# EAGLE schematic MICROCODE (EAGLE 7.6.0)
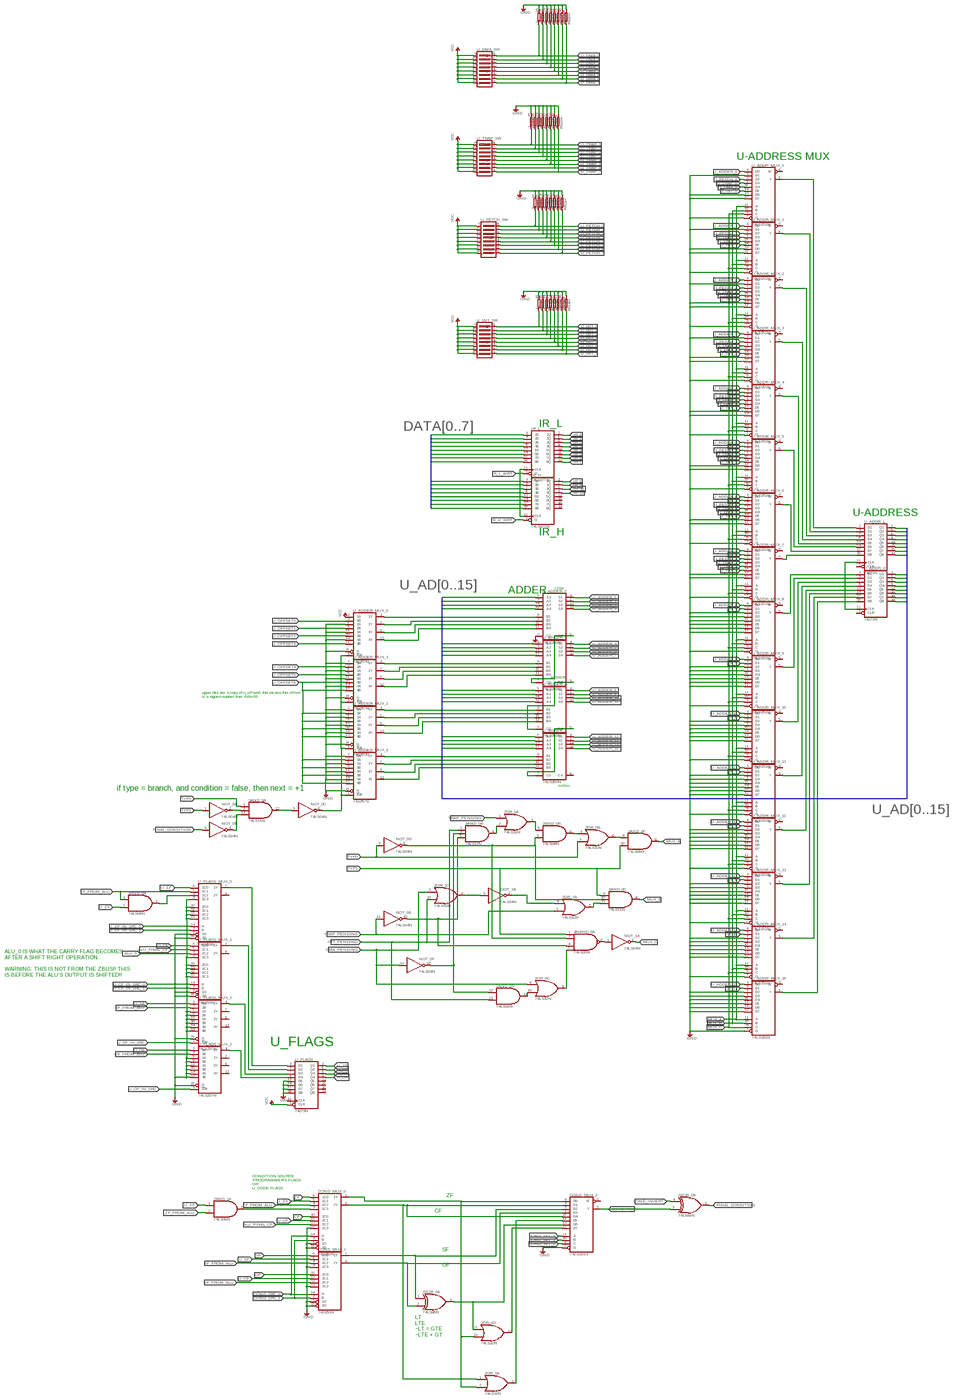
[diagram p0: schematic, sheet 1, overview]
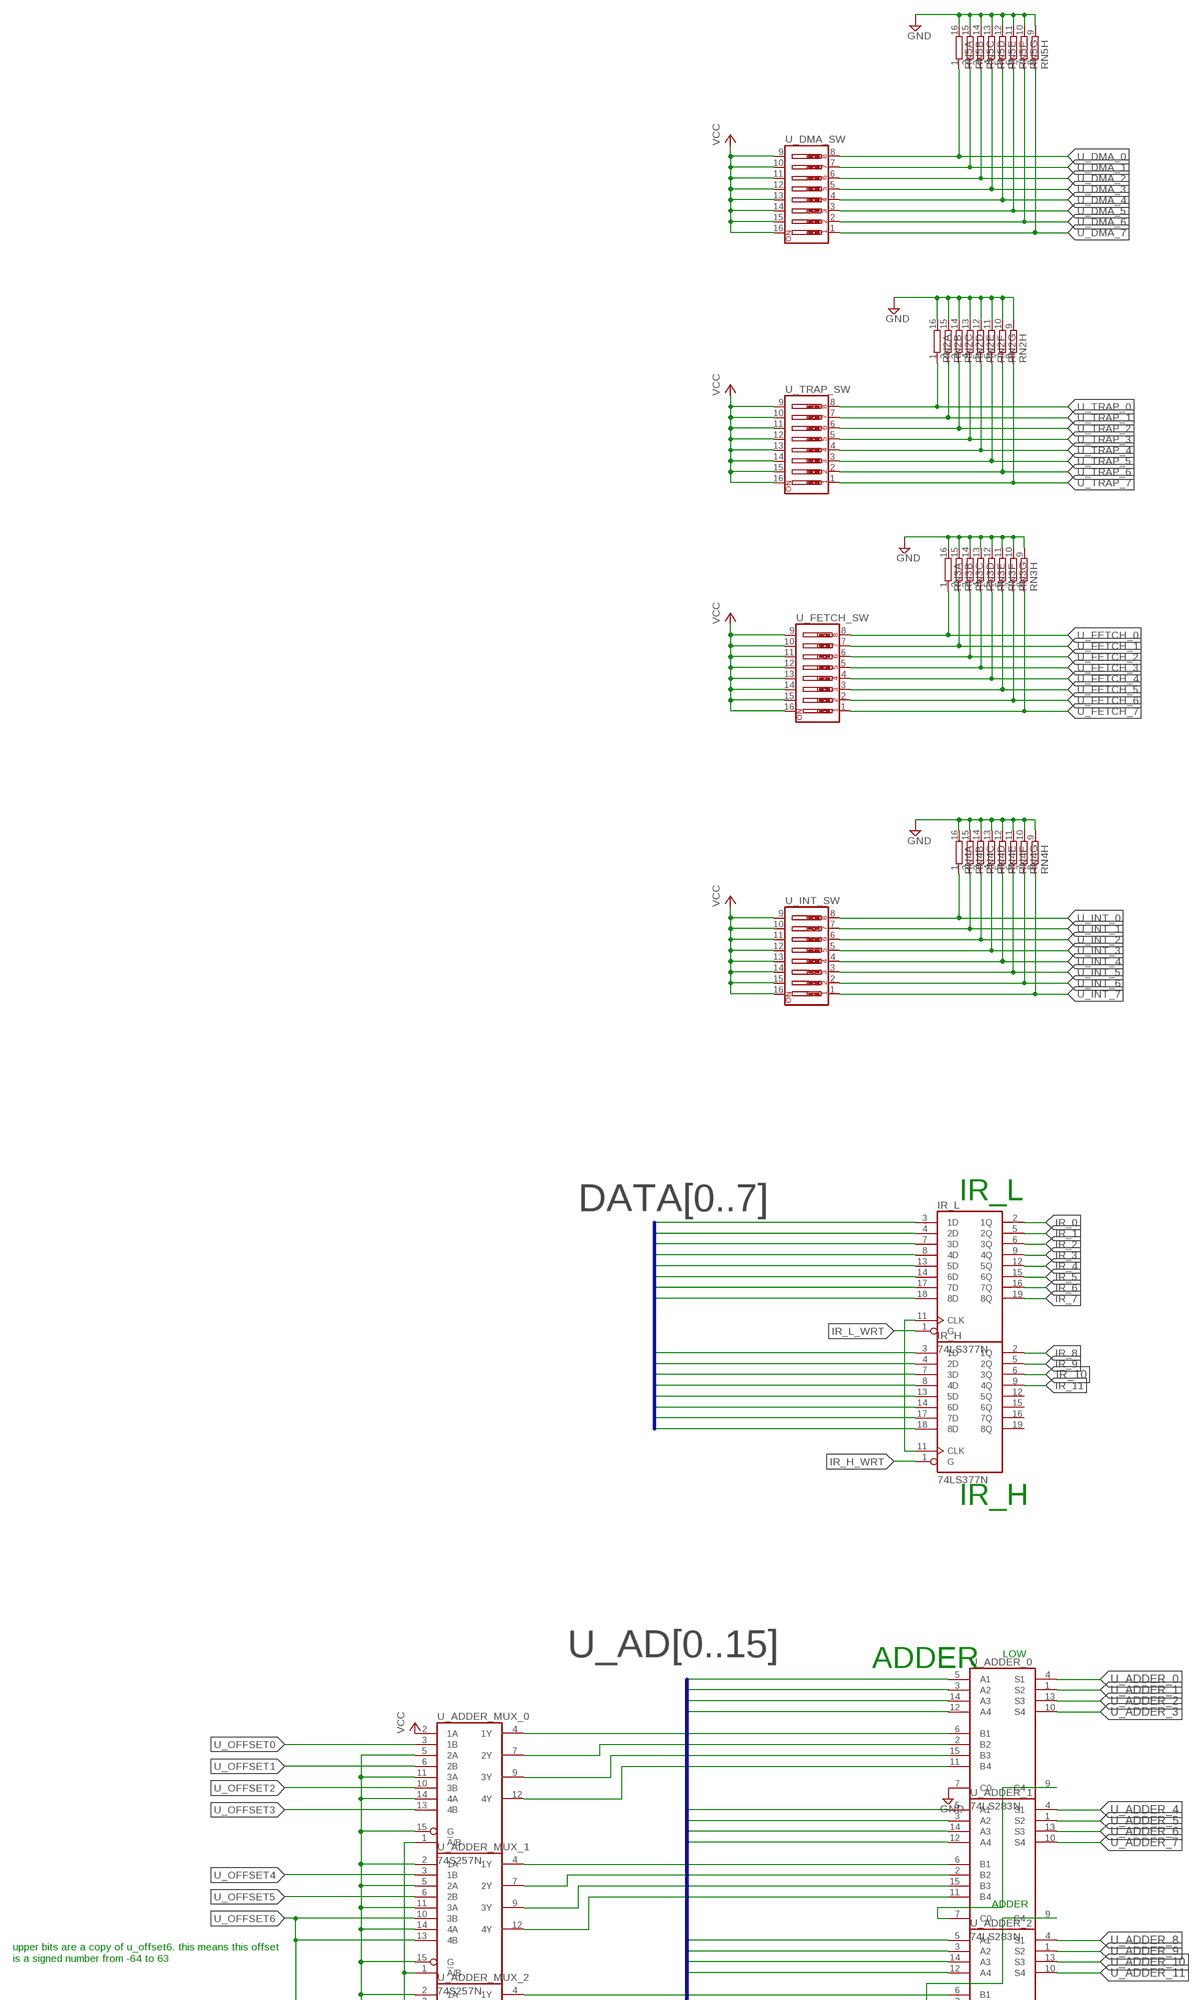
[diagram p1: schematic, sheet 1, part 1 of 4]
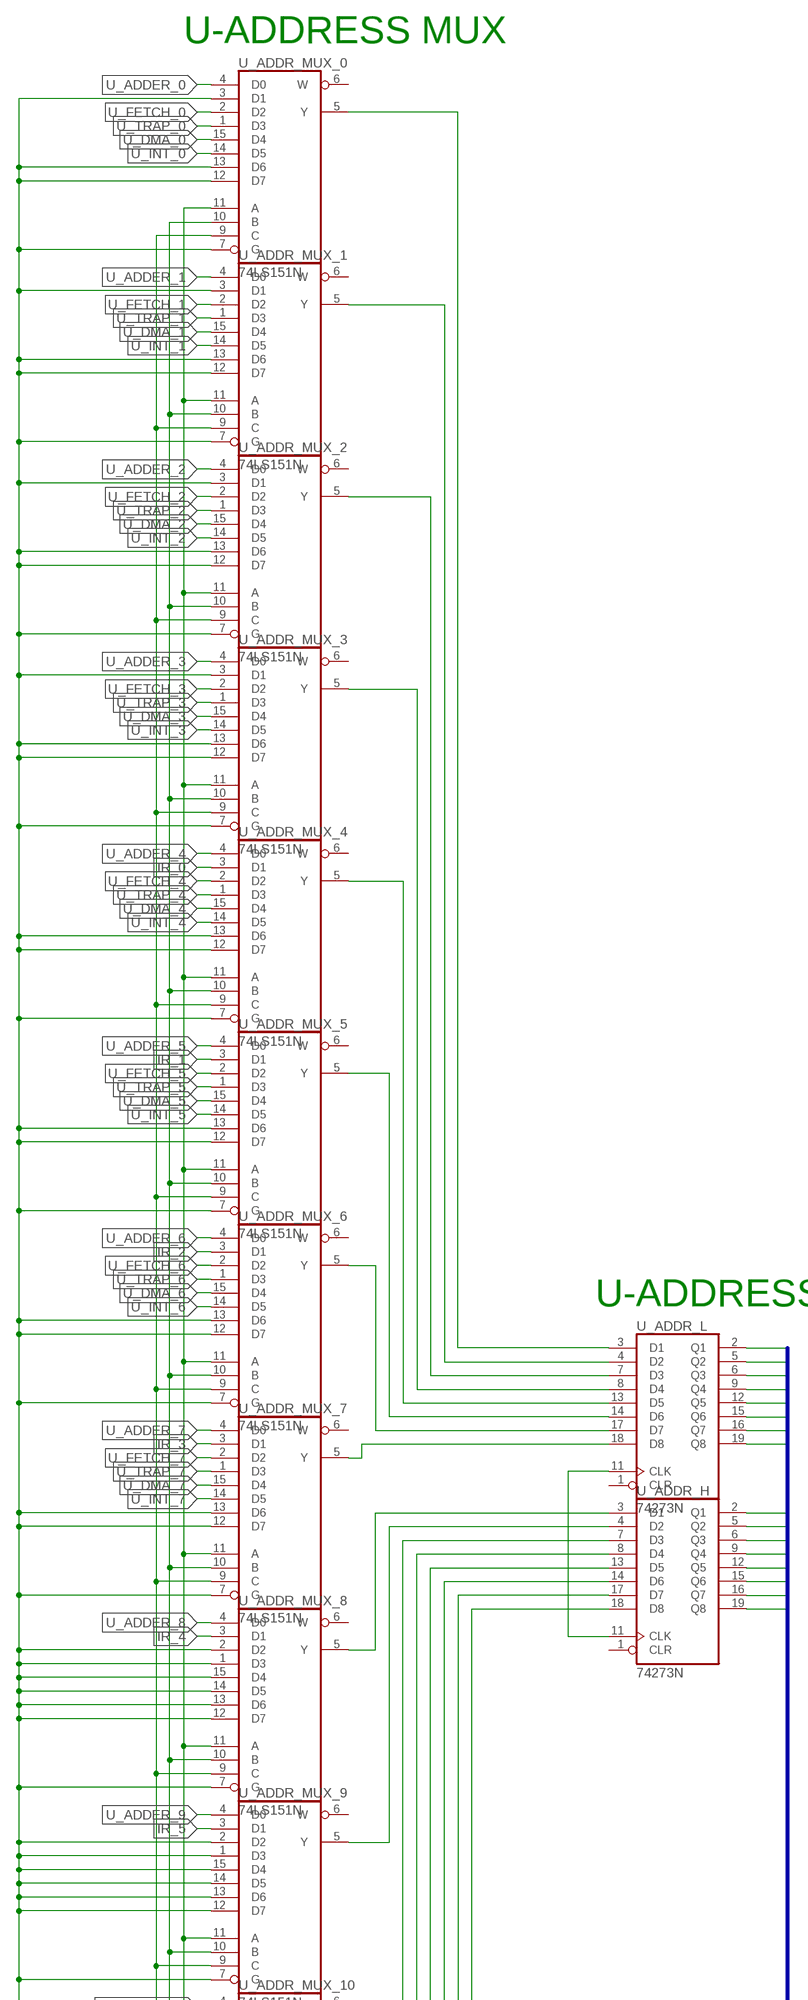
[diagram p2: schematic, sheet 1, part 2 of 4]
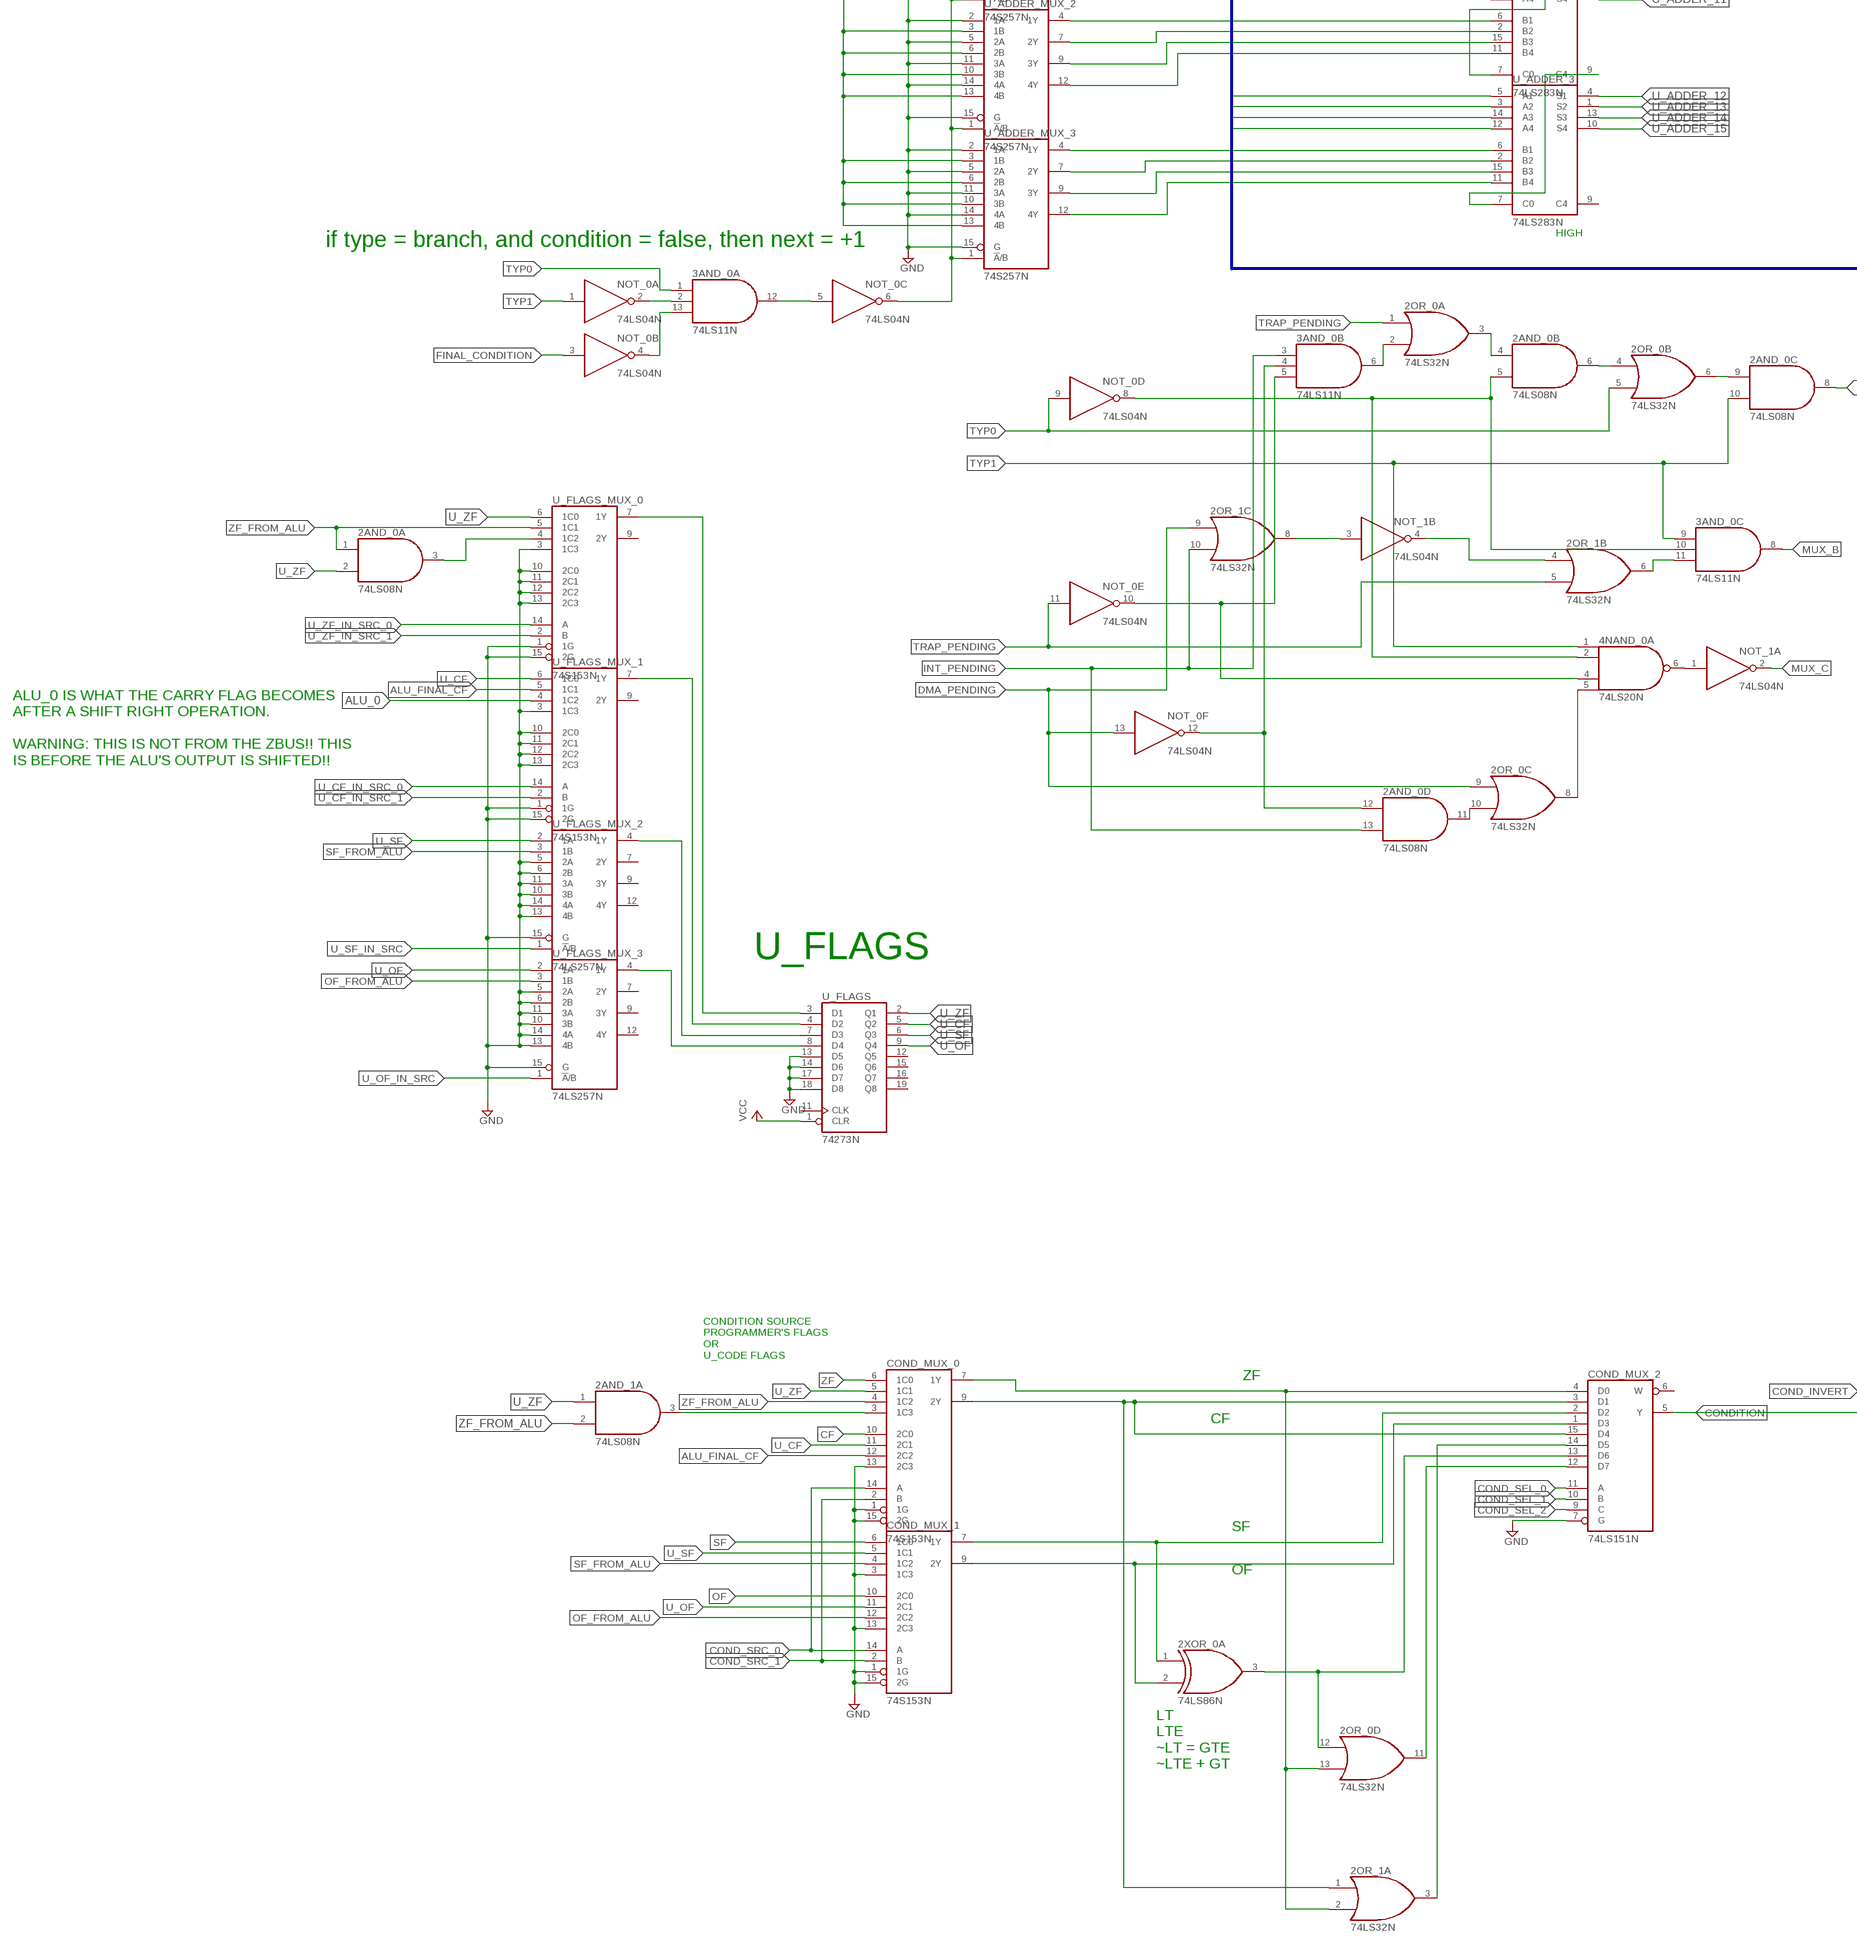
[diagram p3: schematic, sheet 1, part 3 of 4]
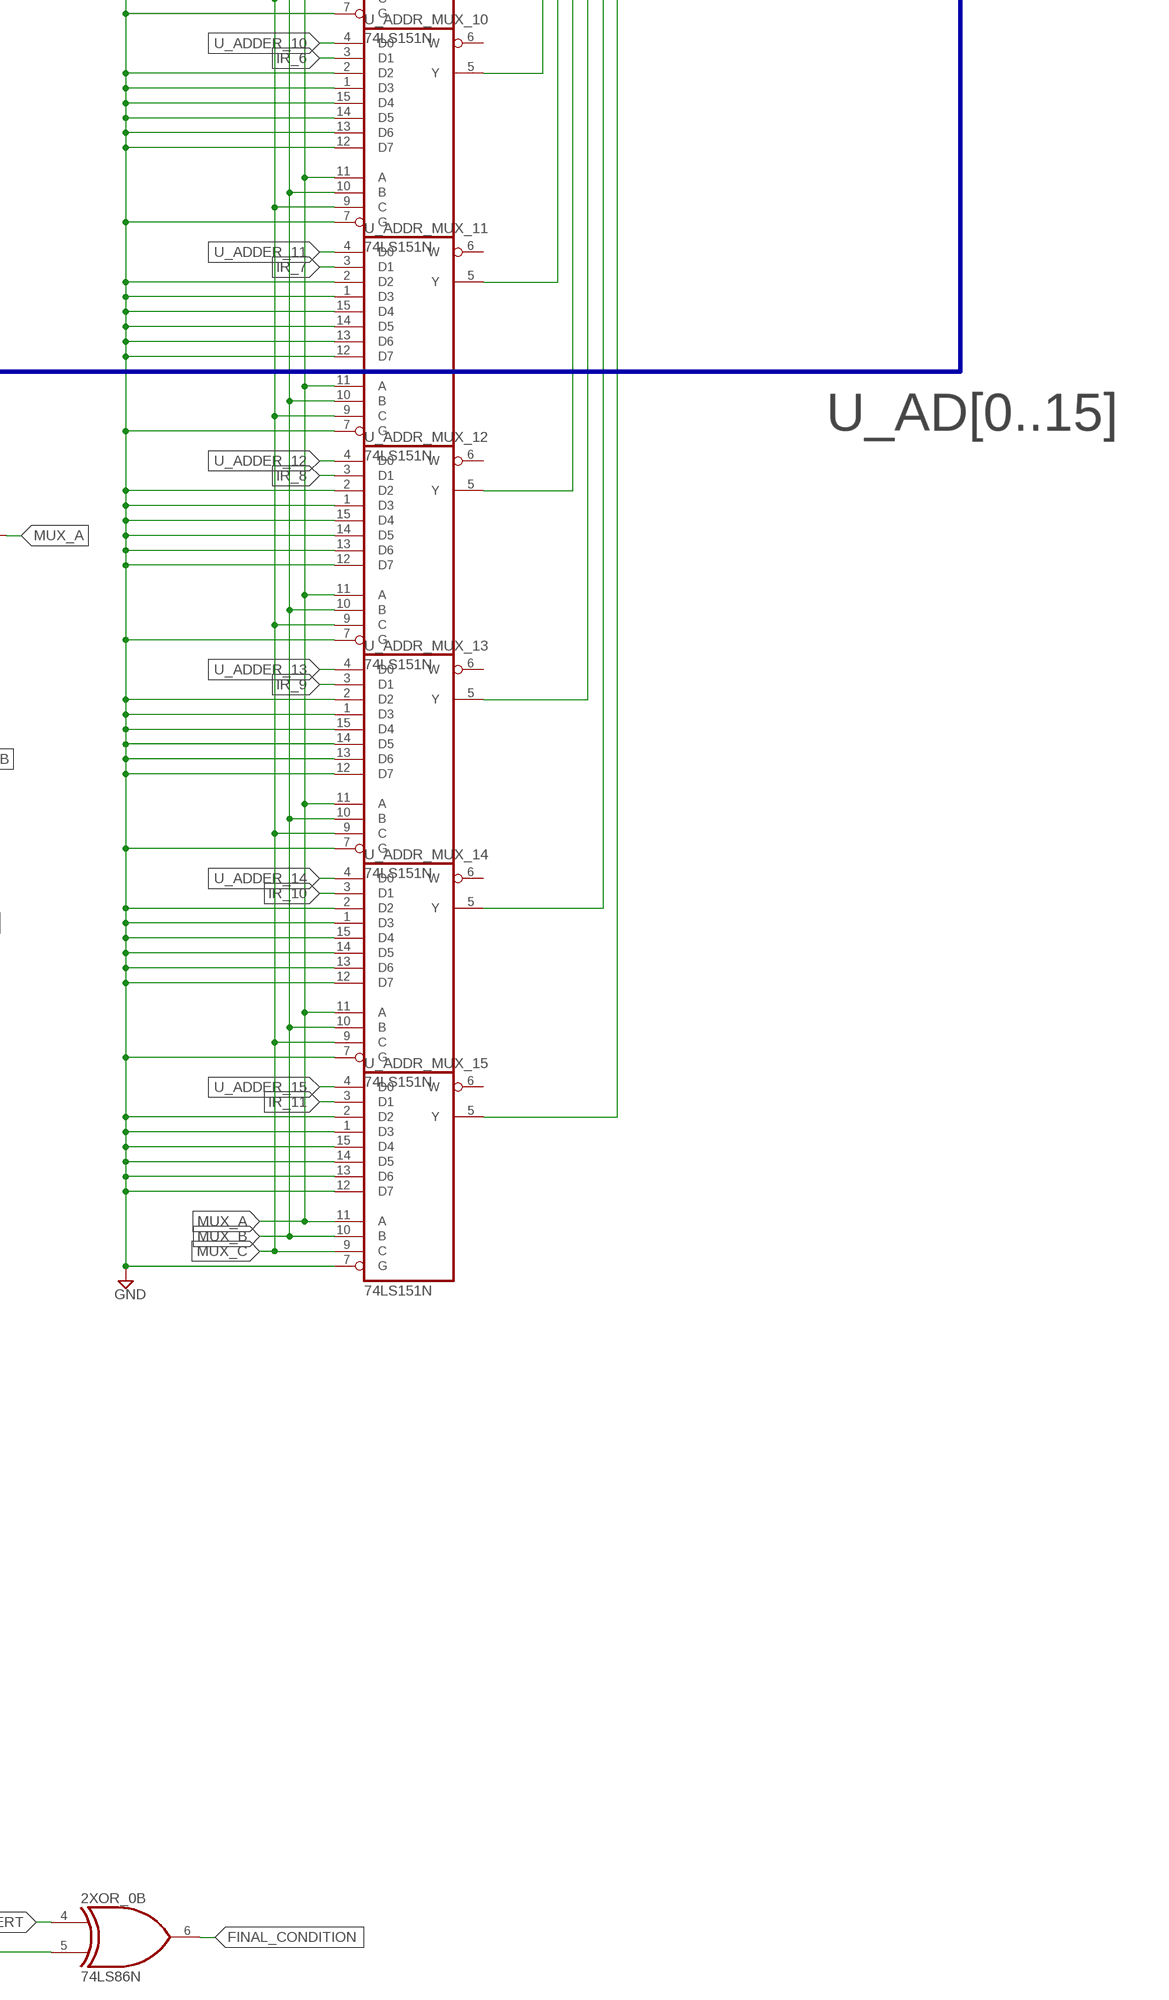
[diagram p4: schematic, sheet 1, part 4 of 4]

## Parts
2AND_0  74LS08N  [DIL14]
2AND_1  74LS08N  [DIL14]
2OR_0  74LS32N  [DIL14]
2OR_1  74LS32N  [DIL14]
2XOR_0  74LS86N  [DIL14]
3AND_0  74LS11N  [DIL14]
4NAND_0  74LS20N  [DIL14]
COND_MUX_0  74S153N  [DIL16]
COND_MUX_1  74S153N  [DIL16]
COND_MUX_2  74LS151N  [DIL16]
IR_H  74LS377N  [DIL20]
IR_L  74LS377N  [DIL20]
NOT_0  74LS04N  [DIL14]
NOT_1  74LS04N  [DIL14]
RN2  8R-N  [DIL16]
RN3  8R-N  [DIL16]
RN4  8R-N  [DIL16]
RN5  8R-N  [DIL16]
U_ADDER_0  74LS283N  [DIL16]
U_ADDER_1  74LS283N  [DIL16]
U_ADDER_2  74LS283N  [DIL16]
U_ADDER_3  74LS283N  [DIL16]
U_ADDER_MUX_0  74S257N  [DIL16]
U_ADDER_MUX_1  74S257N  [DIL16]
U_ADDER_MUX_2  74S257N  [DIL16]
U_ADDER_MUX_3  74S257N  [DIL16]
U_ADDR_H  74273N  [DIL20]
U_ADDR_L  74273N  [DIL20]
U_ADDR_MUX_0  74LS151N  [DIL16]
U_ADDR_MUX_1  74LS151N  [DIL16]
U_ADDR_MUX_2  74LS151N  [DIL16]
U_ADDR_MUX_3  74LS151N  [DIL16]
U_ADDR_MUX_4  74LS151N  [DIL16]
U_ADDR_MUX_5  74LS151N  [DIL16]
U_ADDR_MUX_6  74LS151N  [DIL16]
U_ADDR_MUX_7  74LS151N  [DIL16]
U_ADDR_MUX_8  74LS151N  [DIL16]
U_ADDR_MUX_9  74LS151N  [DIL16]
U_ADDR_MUX_10  74LS151N  [DIL16]
U_ADDR_MUX_11  74LS151N  [DIL16]
U_ADDR_MUX_12  74LS151N  [DIL16]
U_ADDR_MUX_13  74LS151N  [DIL16]
U_ADDR_MUX_14  74LS151N  [DIL16]
U_ADDR_MUX_15  74LS151N  [DIL16]
U_DMA_SW  SW_DIP-8  [EDG-08]
U_FETCH_SW  SW_DIP-8  [EDG-08]
U_FLAGS  74273N  [DIL20]
U_FLAGS_MUX_0  74S153N  [DIL16]
U_FLAGS_MUX_1  74S153N  [DIL16]
U_FLAGS_MUX_2  74LS257N  [DIL16]
U_FLAGS_MUX_3  74LS257N  [DIL16]
U_INT_SW  SW_DIP-8  [EDG-08]
U_TRAP_SW  SW_DIP-8  [EDG-08]

## Nets
1: 2OR_0.13(D:I1) 2OR_1.2(A:I1) COND_MUX_0.7(1Y) COND_MUX_2.4(D0)
2: 2OR_1.1(A:I0) COND_MUX_0.9(2Y) COND_MUX_2.3(D1) COND_MUX_2.15(D4)
3: 2XOR_0.1(A:I0) COND_MUX_1.7(1Y) COND_MUX_2.2(D2)
4: 2XOR_0.2(A:I1) COND_MUX_1.9(2Y) COND_MUX_2.1(D3)
ALU_0: U_FLAGS_MUX_1.4(1C2)
ALU_FINAL_CF: COND_MUX_0.12(2C2) U_FLAGS_MUX_1.5(1C1)
CF: COND_MUX_0.10(2C0)
COND_INVERT: 2XOR_0.4(B:I0)
COND_SEL_0: COND_MUX_2.11(A)
COND_SEL_1: COND_MUX_2.10(B)
COND_SEL_2: COND_MUX_2.9(C)
COND_SRC_0: COND_MUX_0.14(A) COND_MUX_1.14(A)
COND_SRC_1: COND_MUX_0.2(B) COND_MUX_1.2(B)
CONDITION: 2XOR_0.5(B:I1) COND_MUX_2.5(Y)
DATA0: IR_H.3(1D) IR_L.3(1D)
DATA1: IR_H.4(2D) IR_L.4(2D)
DATA2: IR_H.7(3D) IR_L.7(3D)
DATA3: IR_H.8(4D) IR_L.8(4D)
DATA4: IR_H.13(5D) IR_L.13(5D)
DATA5: IR_H.14(6D) IR_L.14(6D)
DATA6: IR_H.17(7D) IR_L.17(7D)
DATA7: IR_H.18(8D) IR_L.18(8D)
DMA_PENDING: 2OR_0.9(C:I0) 2OR_1.9(C:I0) NOT_0.13(F:I)
FINAL_CONDITION: 2XOR_0.6(B:O) NOT_0.3(B:I)
GND: COND_MUX_0.1(1G) COND_MUX_0.13(2C3) COND_MUX_0.15(2G) COND_MUX_1.1(1G) COND_MUX_1.3(1C3) COND_MUX_1.13(2C3) COND_MUX_1.15(2G) COND_MUX_2.7(G) RN2.9 RN2.10 RN2.11 RN2.12 RN2.13 RN2.14 RN2.15 RN2.16 RN3.9 RN3.10 RN3.11 RN3.12 RN3.13 RN3.14 RN3.15 RN3.16 RN4.9 RN4.10 RN4.11 RN4.12 RN4.13 RN4.14 RN4.15 RN4.16 RN5.9 RN5.10 RN5.11 RN5.12 RN5.13 RN5.14 RN5.15 RN5.16 U_ADDER_0.7(C0) U_ADDER_MUX_0.5(2A) U_ADDER_MUX_0.11(3A) U_ADDER_MUX_0.14(4A) U_ADDER_MUX_0.15(G) U_ADDER_MUX_1.2(1A) U_ADDER_MUX_1.5(2A) U_ADDER_MUX_1.11(3A) U_ADDER_MUX_1.14(4A) U_ADDER_MUX_1.15(G) U_ADDER_MUX_2.2(1A) U_ADDER_MUX_2.5(2A) U_ADDER_MUX_2.11(3A) U_ADDER_MUX_2.14(4A) U_ADDER_MUX_2.15(G) U_ADDER_MUX_3.2(1A) U_ADDER_MUX_3.5(2A) U_ADDER_MUX_3.11(3A) U_ADDER_MUX_3.14(4A) U_ADDER_MUX_3.15(G) U_ADDR_MUX_0.3(D1) U_ADDR_MUX_0.7(G) U_ADDR_MUX_0.12(D7) U_ADDR_MUX_0.13(D6) U_ADDR_MUX_1.3(D1) U_ADDR_MUX_1.7(G) U_ADDR_MUX_1.12(D7) U_ADDR_MUX_1.13(D6) U_ADDR_MUX_2.3(D1) U_ADDR_MUX_2.7(G) U_ADDR_MUX_2.12(D7) U_ADDR_MUX_2.13(D6) U_ADDR_MUX_3.3(D1) U_ADDR_MUX_3.7(G) U_ADDR_MUX_3.12(D7) U_ADDR_MUX_3.13(D6) U_ADDR_MUX_4.7(G) U_ADDR_MUX_4.12(D7) U_ADDR_MUX_4.13(D6) U_ADDR_MUX_5.7(G) U_ADDR_MUX_5.12(D7) U_ADDR_MUX_5.13(D6) U_ADDR_MUX_6.7(G) U_ADDR_MUX_6.12(D7) U_ADDR_MUX_6.13(D6) U_ADDR_MUX_7.7(G) U_ADDR_MUX_7.12(D7) U_ADDR_MUX_7.13(D6) U_ADDR_MUX_8.1(D3) U_ADDR_MUX_8.2(D2) U_ADDR_MUX_8.7(G) U_ADDR_MUX_8.12(D7) U_ADDR_MUX_8.13(D6) U_ADDR_MUX_8.14(D5) U_ADDR_MUX_8.15(D4) U_ADDR_MUX_9.1(D3) U_ADDR_MUX_9.2(D2) U_ADDR_MUX_9.7(G) U_ADDR_MUX_9.12(D7) U_ADDR_MUX_9.13(D6) U_ADDR_MUX_9.14(D5) U_ADDR_MUX_9.15(D4) U_ADDR_MUX_10.1(D3) U_ADDR_MUX_10.2(D2) U_ADDR_MUX_10.7(G) U_ADDR_MUX_10.12(D7) U_ADDR_MUX_10.13(D6) U_ADDR_MUX_10.14(D5) U_ADDR_MUX_10.15(D4) U_ADDR_MUX_11.1(D3) U_ADDR_MUX_11.2(D2) U_ADDR_MUX_11.7(G) U_ADDR_MUX_11.12(D7) U_ADDR_MUX_11.13(D6) U_ADDR_MUX_11.14(D5) U_ADDR_MUX_11.15(D4) U_ADDR_MUX_12.1(D3) U_ADDR_MUX_12.2(D2) U_ADDR_MUX_12.7(G) U_ADDR_MUX_12.12(D7) U_ADDR_MUX_12.13(D6) U_ADDR_MUX_12.14(D5) U_ADDR_MUX_12.15(D4) U_ADDR_MUX_13.1(D3) U_ADDR_MUX_13.2(D2) U_ADDR_MUX_13.7(G) U_ADDR_MUX_13.12(D7) U_ADDR_MUX_13.13(D6) U_ADDR_MUX_13.14(D5) U_ADDR_MUX_13.15(D4) U_ADDR_MUX_14.1(D3) U_ADDR_MUX_14.2(D2) U_ADDR_MUX_14.7(G) U_ADDR_MUX_14.12(D7) U_ADDR_MUX_14.13(D6) U_ADDR_MUX_14.14(D5) U_ADDR_MUX_14.15(D4) U_ADDR_MUX_15.1(D3) U_ADDR_MUX_15.2(D2) U_ADDR_MUX_15.7(G) U_ADDR_MUX_15.12(D7) U_ADDR_MUX_15.13(D6) U_ADDR_MUX_15.14(D5) U_ADDR_MUX_15.15(D4) U_FLAGS.13(D5) U_FLAGS.14(D6) U_FLAGS.17(D7) U_FLAGS.18(D8) U_FLAGS_MUX_0.1(1G) U_FLAGS_MUX_0.3(1C3) U_FLAGS_MUX_0.10(2C0) U_FLAGS_MUX_0.11(2C1) U_FLAGS_MUX_0.12(2C2) U_FLAGS_MUX_0.13(2C3) U_FLAGS_MUX_0.15(2G) U_FLAGS_MUX_1.1(1G) U_FLAGS_MUX_1.3(1C3) U_FLAGS_MUX_1.10(2C0) U_FLAGS_MUX_1.11(2C1) U_FLAGS_MUX_1.12(2C2) U_FLAGS_MUX_1.13(2C3) U_FLAGS_MUX_1.15(2G) U_FLAGS_MUX_2.5(2A) U_FLAGS_MUX_2.6(2B) U_FLAGS_MUX_2.10(3B) U_FLAGS_MUX_2.11(3A) U_FLAGS_MUX_2.13(4B) U_FLAGS_MUX_2.14(4A) U_FLAGS_MUX_2.15(G) U_FLAGS_MUX_3.5(2A) U_FLAGS_MUX_3.6(2B) U_FLAGS_MUX_3.10(3B) U_FLAGS_MUX_3.11(3A) U_FLAGS_MUX_3.13(4B) U_FLAGS_MUX_3.14(4A) U_FLAGS_MUX_3.15(G)
INT_PENDING: 2AND_0.13(D:I1) 2OR_1.10(C:I1) 3AND_0.3(B:I0)
IR_0: IR_L.2(1Q) U_ADDR_MUX_4.3(D1)
IR_1: IR_L.5(2Q) U_ADDR_MUX_5.3(D1)
IR_2: IR_L.6(3Q) U_ADDR_MUX_6.3(D1)
IR_3: IR_L.9(4Q) U_ADDR_MUX_7.3(D1)
IR_4: IR_L.12(5Q) U_ADDR_MUX_8.3(D1)
IR_5: IR_L.15(6Q) U_ADDR_MUX_9.3(D1)
IR_6: IR_L.16(7Q) U_ADDR_MUX_10.3(D1)
IR_7: IR_L.19(8Q) U_ADDR_MUX_11.3(D1)
IR_8: IR_H.2(1Q) U_ADDR_MUX_12.3(D1)
IR_9: IR_H.5(2Q) U_ADDR_MUX_13.3(D1)
IR_10: IR_H.6(3Q) U_ADDR_MUX_14.3(D1)
IR_11: IR_H.9(4Q) U_ADDR_MUX_15.3(D1)
IR_H_WRT: IR_H.1(G)
IR_L_WRT: IR_L.1(G)
MUX_A: 2AND_0.8(C:O) U_ADDR_MUX_0.11(A) U_ADDR_MUX_1.11(A) U_ADDR_MUX_2.11(A) U_ADDR_MUX_3.11(A) U_ADDR_MUX_4.11(A) U_ADDR_MUX_5.11(A) U_ADDR_MUX_6.11(A) U_ADDR_MUX_7.11(A) U_ADDR_MUX_8.11(A) U_ADDR_MUX_9.11(A) U_ADDR_MUX_10.11(A) U_ADDR_MUX_11.11(A) U_ADDR_MUX_12.11(A) U_ADDR_MUX_13.11(A) U_ADDR_MUX_14.11(A) U_ADDR_MUX_15.11(A)
MUX_B: 3AND_0.8(C:O) U_ADDR_MUX_0.10(B) U_ADDR_MUX_1.10(B) U_ADDR_MUX_2.10(B) U_ADDR_MUX_3.10(B) U_ADDR_MUX_4.10(B) U_ADDR_MUX_5.10(B) U_ADDR_MUX_6.10(B) U_ADDR_MUX_7.10(B) U_ADDR_MUX_8.10(B) U_ADDR_MUX_9.10(B) U_ADDR_MUX_10.10(B) U_ADDR_MUX_11.10(B) U_ADDR_MUX_12.10(B) U_ADDR_MUX_13.10(B) U_ADDR_MUX_14.10(B) U_ADDR_MUX_15.10(B)
MUX_C: NOT_1.2(A:O) U_ADDR_MUX_0.9(C) U_ADDR_MUX_1.9(C) U_ADDR_MUX_2.9(C) U_ADDR_MUX_3.9(C) U_ADDR_MUX_4.9(C) U_ADDR_MUX_5.9(C) U_ADDR_MUX_6.9(C) U_ADDR_MUX_7.9(C) U_ADDR_MUX_8.9(C) U_ADDR_MUX_9.9(C) U_ADDR_MUX_10.9(C) U_ADDR_MUX_11.9(C) U_ADDR_MUX_12.9(C) U_ADDR_MUX_13.9(C) U_ADDR_MUX_14.9(C) U_ADDR_MUX_15.9(C)
N$1: 2AND_1.3(A:O) COND_MUX_0.3(1C3)
N$2: 3AND_0.12(A:O) NOT_0.5(C:I)
N$3: U_ADDER_0.9(C4) U_ADDER_1.7(C0)
N$4: U_ADDER_2.9(C4) U_ADDER_3.7(C0)
N$5: U_ADDER_0.6(B1) U_ADDER_MUX_0.4(1Y)
N$6: U_ADDER_0.2(B2) U_ADDER_MUX_0.7(2Y)
N$7: U_ADDER_0.15(B3) U_ADDER_MUX_0.9(3Y)
N$8: U_ADDER_0.11(B4) U_ADDER_MUX_0.12(4Y)
N$9: U_ADDER_1.6(B1) U_ADDER_MUX_1.4(1Y)
N$10: U_ADDER_1.2(B2) U_ADDER_MUX_1.7(2Y)
N$11: U_ADDER_1.15(B3) U_ADDER_MUX_1.9(3Y)
N$12: 4NAND_0.6(A:O) NOT_1.1(A:I)
N$13: U_ADDER_1.11(B4) U_ADDER_MUX_1.12(4Y)
N$14: 2OR_1.6(B:O) 3AND_0.11(C:I2)
N$15: U_ADDER_2.6(B1) U_ADDER_MUX_2.4(1Y)
N$16: U_ADDER_2.2(B2) U_ADDER_MUX_2.7(2Y)
N$17: U_ADDER_2.15(B3) U_ADDER_MUX_2.9(3Y)
N$18: U_ADDER_2.11(B4) U_ADDER_MUX_2.12(4Y)
N$19: U_ADDER_3.6(B1) U_ADDER_MUX_3.4(1Y)
N$20: U_ADDER_3.2(B2) U_ADDER_MUX_3.7(2Y)
N$21: NOT_0.6(C:O) U_ADDER_MUX_0.1(!A!/B) U_ADDER_MUX_1.1(!A!/B) U_ADDER_MUX_2.1(!A!/B) U_ADDER_MUX_3.1(!A!/B)
N$22: 3AND_0.13(A:I2) NOT_0.4(B:O)
N$23: 3AND_0.2(A:I1) NOT_0.2(A:O)
N$24: U_ADDR_L.3(D1) U_ADDR_MUX_0.5(Y)
N$25: U_ADDR_L.4(D2) U_ADDR_MUX_1.5(Y)
N$26: U_ADDR_L.7(D3) U_ADDR_MUX_2.5(Y)
N$27: U_ADDR_L.8(D4) U_ADDR_MUX_3.5(Y)
N$28: U_ADDR_L.13(D5) U_ADDR_MUX_4.5(Y)
N$29: U_ADDR_L.14(D6) U_ADDR_MUX_5.5(Y)
N$30: U_ADDR_L.17(D7) U_ADDR_MUX_6.5(Y)
N$31: U_ADDR_L.18(D8) U_ADDR_MUX_7.5(Y)
N$32: U_ADDR_H.3(D1) U_ADDR_MUX_8.5(Y)
N$33: U_ADDR_H.4(D2) U_ADDR_MUX_9.5(Y)
N$34: U_ADDR_H.7(D3) U_ADDR_MUX_10.5(Y)
N$35: U_ADDR_H.11(CLK) U_ADDR_L.11(CLK)
N$36: IR_H.11(CLK) IR_L.11(CLK)
N$37: 2OR_1.4(B:I0) NOT_1.4(B:O)
N$38: 2OR_1.8(C:O) NOT_1.3(B:I)
N$41: U_ADDR_H.8(D4) U_ADDR_MUX_11.5(Y)
N$42: U_ADDR_H.13(D5) U_ADDR_MUX_12.5(Y)
N$43: U_ADDR_H.14(D6) U_ADDR_MUX_13.5(Y)
N$45: U_ADDER_3.15(B3) U_ADDER_MUX_3.9(3Y)
N$46: U_ADDER_3.11(B4) U_ADDER_MUX_3.12(4Y)
N$47: U_FLAGS.4(D2) U_FLAGS_MUX_1.7(1Y)
N$48: 2AND_0.3(A:O) U_FLAGS_MUX_0.4(1C2)
N$49: U_FLAGS.3(D1) U_FLAGS_MUX_0.7(1Y)
N$50: U_FLAGS.8(D4) U_FLAGS_MUX_3.4(1Y)
N$51: U_FLAGS.7(D3) U_FLAGS_MUX_2.4(1Y)
N$86: 2OR_1.3(A:O) COND_MUX_2.14(D5)
N$93: 2OR_0.11(D:O) COND_MUX_2.12(D7)
N$94: 2AND_0.9(C:I0) 2OR_0.6(B:O)
N$130: 2AND_0.6(B:O) 2OR_0.4(B:I0)
N$173: 2AND_0.5(B:I1) 3AND_0.10(C:I1) 4NAND_0.2(A:I1) NOT_0.8(D:O)
N$225: U_ADDR_H.17(D7) U_ADDR_MUX_14.5(Y)
N$228: U_ADDR_H.18(D8) U_ADDR_MUX_15.5(Y)
N$358: U_ADDER_1.9(C4) U_ADDER_2.7(C0)
N$705: 2AND_0.4(B:I0) 2OR_0.3(A:O)
N$706: 2OR_0.2(A:I1) 3AND_0.6(B:O)
N$707: 3AND_0.5(B:I2) 4NAND_0.4(A:I2) NOT_0.10(E:O)
N$708: 2AND_0.12(D:I0) 3AND_0.4(B:I1) NOT_0.12(F:O)
N$710: 2AND_0.11(D:O) 2OR_0.10(C:I1)
N$711: 2OR_0.8(C:O) 4NAND_0.5(A:I3)
OF: COND_MUX_1.10(2C0)
OF_FROM_ALU: COND_MUX_1.12(2C2) U_FLAGS_MUX_3.3(1B)
SF: COND_MUX_1.6(1C0)
SF_FROM_ALU: COND_MUX_1.4(1C2) U_FLAGS_MUX_2.3(1B)
SF_XOR_OF1: 2OR_0.12(D:I0) 2XOR_0.3(A:O) COND_MUX_2.13(D6)
TRAP_PENDING: 2OR_0.1(A:I0) 2OR_1.5(B:I1) NOT_0.11(E:I)
TYP0: 2OR_0.5(B:I1) 3AND_0.1(A:I0) NOT_0.9(D:I)
TYP1: 2AND_0.10(C:I1) 3AND_0.9(C:I0) 4NAND_0.1(A:I0) NOT_0.1(A:I)
U_AD0: U_ADDER_0.5(A1) U_ADDR_L.2(Q1)
U_AD1: U_ADDER_0.3(A2) U_ADDR_L.5(Q2)
U_AD2: U_ADDER_0.14(A3) U_ADDR_L.6(Q3)
U_AD3: U_ADDER_0.12(A4) U_ADDR_L.9(Q4)
U_AD4: U_ADDER_1.5(A1) U_ADDR_L.12(Q5)
U_AD5: U_ADDER_1.3(A2) U_ADDR_L.15(Q6)
U_AD6: U_ADDER_1.14(A3) U_ADDR_L.16(Q7)
U_AD7: U_ADDER_1.12(A4) U_ADDR_L.19(Q8)
U_AD8: U_ADDER_2.5(A1) U_ADDR_H.2(Q1)
U_AD9: U_ADDER_2.3(A2) U_ADDR_H.5(Q2)
U_AD10: U_ADDER_2.14(A3) U_ADDR_H.6(Q3)
U_AD11: U_ADDER_2.12(A4) U_ADDR_H.9(Q4)
U_AD12: U_ADDER_3.5(A1) U_ADDR_H.12(Q5)
U_AD13: U_ADDER_3.3(A2) U_ADDR_H.15(Q6)
U_AD14: U_ADDER_3.14(A3) U_ADDR_H.16(Q7)
U_AD15: U_ADDER_3.12(A4) U_ADDR_H.19(Q8)
U_ADDER_0: U_ADDER_0.4(S1) U_ADDR_MUX_0.4(D0)
U_ADDER_1: U_ADDER_0.1(S2) U_ADDR_MUX_1.4(D0)
U_ADDER_2: U_ADDER_0.13(S3) U_ADDR_MUX_2.4(D0)
U_ADDER_3: U_ADDER_0.10(S4) U_ADDR_MUX_3.4(D0)
U_ADDER_4: U_ADDER_1.4(S1) U_ADDR_MUX_4.4(D0)
U_ADDER_5: U_ADDER_1.1(S2) U_ADDR_MUX_5.4(D0)
U_ADDER_6: U_ADDER_1.13(S3) U_ADDR_MUX_6.4(D0)
U_ADDER_7: U_ADDER_1.10(S4) U_ADDR_MUX_7.4(D0)
U_ADDER_8: U_ADDER_2.4(S1) U_ADDR_MUX_8.4(D0)
U_ADDER_9: U_ADDER_2.1(S2) U_ADDR_MUX_9.4(D0)
U_ADDER_10: U_ADDER_2.13(S3) U_ADDR_MUX_10.4(D0)
U_ADDER_11: U_ADDER_2.10(S4) U_ADDR_MUX_11.4(D0)
U_ADDER_12: U_ADDER_3.4(S1) U_ADDR_MUX_12.4(D0)
U_ADDER_13: U_ADDER_3.1(S2) U_ADDR_MUX_13.4(D0)
U_ADDER_14: U_ADDER_3.13(S3) U_ADDR_MUX_14.4(D0)
U_ADDER_15: U_ADDER_3.10(S4) U_ADDR_MUX_15.4(D0)
U_CF: COND_MUX_0.11(2C1) U_FLAGS.5(Q2) U_FLAGS_MUX_1.6(1C0)
U_CF_IN_SRC_0: U_FLAGS_MUX_1.14(A)
U_CF_IN_SRC_1: U_FLAGS_MUX_1.2(B)
U_DMA_0: RN5.1 U_ADDR_MUX_0.15(D4) U_DMA_SW.8
U_DMA_1: RN5.2 U_ADDR_MUX_1.15(D4) U_DMA_SW.7
U_DMA_2: RN5.3 U_ADDR_MUX_2.15(D4) U_DMA_SW.6
U_DMA_3: RN5.4 U_ADDR_MUX_3.15(D4) U_DMA_SW.5
U_DMA_4: RN5.5 U_ADDR_MUX_4.15(D4) U_DMA_SW.4
U_DMA_5: RN5.6 U_ADDR_MUX_5.15(D4) U_DMA_SW.3
U_DMA_6: RN5.7 U_ADDR_MUX_6.15(D4) U_DMA_SW.2
U_DMA_7: RN5.8 U_ADDR_MUX_7.15(D4) U_DMA_SW.1
U_FETCH_0: RN3.1 U_ADDR_MUX_0.2(D2) U_FETCH_SW.8
U_FETCH_1: RN3.2 U_ADDR_MUX_1.2(D2) U_FETCH_SW.7
U_FETCH_2: RN3.3 U_ADDR_MUX_2.2(D2) U_FETCH_SW.6
U_FETCH_3: RN3.4 U_ADDR_MUX_3.2(D2) U_FETCH_SW.5
U_FETCH_4: RN3.5 U_ADDR_MUX_4.2(D2) U_FETCH_SW.4
U_FETCH_5: RN3.6 U_ADDR_MUX_5.2(D2) U_FETCH_SW.3
U_FETCH_6: RN3.7 U_ADDR_MUX_6.2(D2) U_FETCH_SW.2
U_FETCH_7: RN3.8 U_ADDR_MUX_7.2(D2) U_FETCH_SW.1
U_INT_0: RN4.1 U_ADDR_MUX_0.14(D5) U_INT_SW.8
U_INT_1: RN4.2 U_ADDR_MUX_1.14(D5) U_INT_SW.7
U_INT_2: RN4.3 U_ADDR_MUX_2.14(D5) U_INT_SW.6
U_INT_3: RN4.4 U_ADDR_MUX_3.14(D5) U_INT_SW.5
U_INT_4: RN4.5 U_ADDR_MUX_4.14(D5) U_INT_SW.4
U_INT_5: RN4.6 U_ADDR_MUX_5.14(D5) U_INT_SW.3
U_INT_6: RN4.7 U_ADDR_MUX_6.14(D5) U_INT_SW.2
U_INT_7: RN4.8 U_ADDR_MUX_7.14(D5) U_INT_SW.1
U_OF: COND_MUX_1.11(2C1) U_FLAGS.9(Q4) U_FLAGS_MUX_3.2(1A)
U_OF_IN_SRC: U_FLAGS_MUX_3.1(!A!/B)
U_OFFSET0: U_ADDER_MUX_0.3(1B)
U_OFFSET1: U_ADDER_MUX_0.6(2B)
U_OFFSET2: U_ADDER_MUX_0.10(3B)
U_OFFSET3: U_ADDER_MUX_0.13(4B)
U_OFFSET4: U_ADDER_MUX_1.3(1B)
U_OFFSET5: U_ADDER_MUX_1.6(2B)
U_OFFSET6: U_ADDER_MUX_1.10(3B) U_ADDER_MUX_1.13(4B) U_ADDER_MUX_2.3(1B) U_ADDER_MUX_2.6(2B) U_ADDER_MUX_2.10(3B) U_ADDER_MUX_2.13(4B) U_ADDER_MUX_3.3(1B) U_ADDER_MUX_3.6(2B) U_ADDER_MUX_3.10(3B) U_ADDER_MUX_3.13(4B)
U_SF: COND_MUX_1.5(1C1) U_FLAGS.6(Q3) U_FLAGS_MUX_2.2(1A)
U_SF_IN_SRC: U_FLAGS_MUX_2.1(!A!/B)
U_TRAP_0: RN2.1 U_ADDR_MUX_0.1(D3) U_TRAP_SW.8
U_TRAP_1: RN2.2 U_ADDR_MUX_1.1(D3) U_TRAP_SW.7
U_TRAP_2: RN2.3 U_ADDR_MUX_2.1(D3) U_TRAP_SW.6
U_TRAP_3: RN2.4 U_ADDR_MUX_3.1(D3) U_TRAP_SW.5
U_TRAP_4: RN2.5 U_ADDR_MUX_4.1(D3) U_TRAP_SW.4
U_TRAP_5: RN2.6 U_ADDR_MUX_5.1(D3) U_TRAP_SW.3
U_TRAP_6: RN2.7 U_ADDR_MUX_6.1(D3) U_TRAP_SW.2
U_TRAP_7: RN2.8 U_ADDR_MUX_7.1(D3) U_TRAP_SW.1
U_ZF: 2AND_0.2(A:I1) 2AND_1.1(A:I0) COND_MUX_0.5(1C1) U_FLAGS.2(Q1) U_FLAGS_MUX_0.6(1C0)
U_ZF_IN_SRC_0: U_FLAGS_MUX_0.14(A)
U_ZF_IN_SRC_1: U_FLAGS_MUX_0.2(B)
VCC: U_ADDER_MUX_0.2(1A) U_DMA_SW.9 U_DMA_SW.10 U_DMA_SW.11 U_DMA_SW.12 U_DMA_SW.13 U_DMA_SW.14 U_DMA_SW.15 U_DMA_SW.16 U_FETCH_SW.9 U_FETCH_SW.10 U_FETCH_SW.11 U_FETCH_SW.12 U_FETCH_SW.13 U_FETCH_SW.14 U_FETCH_SW.15 U_FETCH_SW.16 U_FLAGS.1(CLR) U_INT_SW.9 U_INT_SW.10 U_INT_SW.11 U_INT_SW.12 U_INT_SW.13 U_INT_SW.14 U_INT_SW.15 U_INT_SW.16 U_TRAP_SW.9 U_TRAP_SW.10 U_TRAP_SW.11 U_TRAP_SW.12 U_TRAP_SW.13 U_TRAP_SW.14 U_TRAP_SW.15 U_TRAP_SW.16
ZF: COND_MUX_0.6(1C0)
ZF_FROM_ALU: 2AND_0.1(A:I0) 2AND_1.2(A:I1) COND_MUX_0.4(1C2) U_FLAGS_MUX_0.5(1C1)
Unconnected: 2AND_1.4(B:I0) 2AND_1.5(B:I1) 2AND_1.6(B:O) 2AND_1.8(C:O) 2AND_1.9(C:I0) 2AND_1.10(C:I1) 2AND_1.11(D:O) 2AND_1.12(D:I0) 2AND_1.13(D:I1) 2OR_1.11(D:O) 2OR_1.12(D:I0) 2OR_1.13(D:I1) 2XOR_0.8(C:O) 2XOR_0.9(C:I0) 2XOR_0.10(C:I1) 2XOR_0.11(D:O) 2XOR_0.12(D:I0) 2XOR_0.13(D:I1) 4NAND_0.8(B:O) 4NAND_0.9(B:I0) 4NAND_0.10(B:I1) 4NAND_0.12(B:I2) 4NAND_0.13(B:I3) COND_MUX_2.6(W) IR_H.12(5Q) IR_H.15(6Q) IR_H.16(7Q) IR_H.19(8Q) NOT_1.5(C:I) NOT_1.6(C:O) NOT_1.8(D:O) NOT_1.9(D:I) NOT_1.10(E:O) NOT_1.11(E:I) NOT_1.12(F:O) NOT_1.13(F:I) U_ADDER_3.9(C4) U_ADDR_H.1(CLR) U_ADDR_L.1(CLR) U_ADDR_MUX_0.6(W) U_ADDR_MUX_1.6(W) U_ADDR_MUX_2.6(W) U_ADDR_MUX_3.6(W) U_ADDR_MUX_4.6(W) U_ADDR_MUX_5.6(W) U_ADDR_MUX_6.6(W) U_ADDR_MUX_7.6(W) U_ADDR_MUX_8.6(W) U_ADDR_MUX_9.6(W) U_ADDR_MUX_10.6(W) U_ADDR_MUX_11.6(W) U_ADDR_MUX_12.6(W) U_ADDR_MUX_13.6(W) U_ADDR_MUX_14.6(W) U_ADDR_MUX_15.6(W) U_FLAGS.11(CLK) U_FLAGS.12(Q5) U_FLAGS.15(Q6) U_FLAGS.16(Q7) U_FLAGS.19(Q8) U_FLAGS_MUX_0.9(2Y) U_FLAGS_MUX_1.9(2Y) U_FLAGS_MUX_2.7(2Y) U_FLAGS_MUX_2.9(3Y) U_FLAGS_MUX_2.12(4Y) U_FLAGS_MUX_3.7(2Y) U_FLAGS_MUX_3.9(3Y) U_FLAGS_MUX_3.12(4Y)

## Buses
U_AD[0..15]
DATA[0..7]

## Notes on the sheet
- U-ADDRESS MUX
- IR_L
- U-ADDRESS
- IR_H
- LOW
- ADDER
- ADDER
- upper bits are a copy of u_offset6. this means this offset
  is a signed number from -64 to 63
- HIGH
- if type = branch, and condition = false, then next = +1
- ALU_0 IS WHAT THE CARRY FLAG BECOMES
  AFTER A SHIFT RIGHT OPERATION.
  
  WARNING: THIS IS NOT FROM THE ZBUS!! THIS
  IS BEFORE THE ALU'S OUTPUT IS SHIFTED!!
- U_FLAGS
- CONDITION SOURCE
  PROGRAMMER'S FLAGS 
  OR
  U_CODE FLAGS
- ZF
- CF
- SF
- OF
- LT
  LTE
  ~LT = GTE
  ~LTE + GT

## Power pins joined to a net without a drawn wire
GND: 2AND_0.7(P:GND) 2AND_1.7(P:GND) 2OR_0.7(P:GND) 2OR_1.7(P:GND) 2XOR_0.7(P:GND) 3AND_0.7(P:GND) 4NAND_0.7(P:GND) COND_MUX_0.8(GND) COND_MUX_1.8(GND) COND_MUX_2.8(GND) IR_H.10(GND) IR_L.10(GND) NOT_0.7(P:GND) NOT_1.7(P:GND) U_ADDER_0.8(GND) U_ADDER_1.8(GND) U_ADDER_2.8(GND) U_ADDER_3.8(GND) U_ADDER_MUX_0.8(GND) U_ADDER_MUX_1.8(GND) U_ADDER_MUX_2.8(GND) U_ADDER_MUX_3.8(GND) U_ADDR_H.10(GND) U_ADDR_L.10(GND) U_ADDR_MUX_0.8(GND) U_ADDR_MUX_1.8(GND) U_ADDR_MUX_2.8(GND) U_ADDR_MUX_3.8(GND) U_ADDR_MUX_4.8(GND) U_ADDR_MUX_5.8(GND) U_ADDR_MUX_6.8(GND) U_ADDR_MUX_7.8(GND) U_ADDR_MUX_8.8(GND) U_ADDR_MUX_9.8(GND) U_ADDR_MUX_10.8(GND) U_ADDR_MUX_11.8(GND) U_ADDR_MUX_12.8(GND) U_ADDR_MUX_13.8(GND) U_ADDR_MUX_14.8(GND) U_ADDR_MUX_15.8(GND) U_FLAGS.10(GND) U_FLAGS_MUX_0.8(GND) U_FLAGS_MUX_1.8(GND) U_FLAGS_MUX_2.8(GND) U_FLAGS_MUX_3.8(GND)
VCC: 2AND_0.14(P:VCC) 2AND_1.14(P:VCC) 2OR_0.14(P:VCC) 2OR_1.14(P:VCC) 2XOR_0.14(P:VCC) 3AND_0.14(P:VCC) 4NAND_0.14(P:VCC) COND_MUX_0.16(VCC) COND_MUX_1.16(VCC) COND_MUX_2.16(VCC) IR_H.20(VCC) IR_L.20(VCC) NOT_0.14(P:VCC) NOT_1.14(P:VCC) U_ADDER_0.16(VCC) U_ADDER_1.16(VCC) U_ADDER_2.16(VCC) U_ADDER_3.16(VCC) U_ADDER_MUX_0.16(VCC) U_ADDER_MUX_1.16(VCC) U_ADDER_MUX_2.16(VCC) U_ADDER_MUX_3.16(VCC) U_ADDR_H.20(VCC) U_ADDR_L.20(VCC) U_ADDR_MUX_0.16(VCC) U_ADDR_MUX_1.16(VCC) U_ADDR_MUX_2.16(VCC) U_ADDR_MUX_3.16(VCC) U_ADDR_MUX_4.16(VCC) U_ADDR_MUX_5.16(VCC) U_ADDR_MUX_6.16(VCC) U_ADDR_MUX_7.16(VCC) U_ADDR_MUX_8.16(VCC) U_ADDR_MUX_9.16(VCC) U_ADDR_MUX_10.16(VCC) U_ADDR_MUX_11.16(VCC) U_ADDR_MUX_12.16(VCC) U_ADDR_MUX_13.16(VCC) U_ADDR_MUX_14.16(VCC) U_ADDR_MUX_15.16(VCC) U_FLAGS.20(VCC) U_FLAGS_MUX_0.16(VCC) U_FLAGS_MUX_1.16(VCC) U_FLAGS_MUX_2.16(VCC) U_FLAGS_MUX_3.16(VCC)

## Library data of the parts
2AND_0 2AND_1 = 74xx-us:74*08: Quad 2-input AND gate
2OR_0 2OR_1 = 74xx-us:74*32: Quad 2-input OR gate
2XOR_0 = 74xx-us:74*86: Quad 2-input EXCLUSIV-OR (XOR) gate
3AND_0 = 74xx-us:74*11: Triple 3-input AND gate
4NAND_0 = 74xx-us:74*20: Dual 4-input NAND gate
COND_MUX_0 COND_MUX_1 U_FLAGS_MUX_0 U_FLAGS_MUX_1 = 74xx-us:74*153: Dual 4-line to 1-line data SELECTOR/MULTIPLEXER; OC_FARNELL: unknown
COND_MUX_2 U_ADDR_MUX_0 U_ADDR_MUX_1-U_ADDR_MUX_15 = 74xx-us:74*151: Data SELECTOR/MULTIPLEXER
IR_H IR_L = 74xx-us:74*377: Octal D type FLIP FLOP, enable
NOT_0 NOT_1 = 74xx-us:74*04: Hex INVERTER
RN2-RN5 = resistor-dil:8R-N: DIL RESISTOR; OC_FARNELL: unknown; OC_NEWARK: unknown
U_ADDER_0 U_ADDER_1-U_ADDER_3 = 74xx-us:74*283: 4-bit binary FULL ADDER, fast carry; OC_FARNELL: unknown
U_ADDER_MUX_0 U_ADDER_MUX_1-U_ADDER_MUX_3 = 74xx-us:74*257: Quadruple 2-to 1 line data SELECTOR/MULTIPLEXER; OC_FARNELL: unknown
U_ADDR_H U_ADDR_L = 74xx-us:74*273: Octal D type FLIP FLOP, clear; OC_FARNELL: unknown
U_DMA_SW U_FETCH_SW U_INT_SW U_TRAP_SW = special:SW_DIP-8: DIP SWITCH
U_FLAGS = 74xx-us:74*273: Octal D type FLIP FLOP, clear
U_FLAGS_MUX_2 U_FLAGS_MUX_3 = 74xx-us:74*257: Quadruple 2-to 1 line data SELECTOR/MULTIPLEXER